# EasyEDA schematic easyeda.json
TITLE: welcome-ligh-up; REV: 1.0; Date: 2021-08-14; Sheet: 1/1; Drawn By: wednesday; Company: Your Company
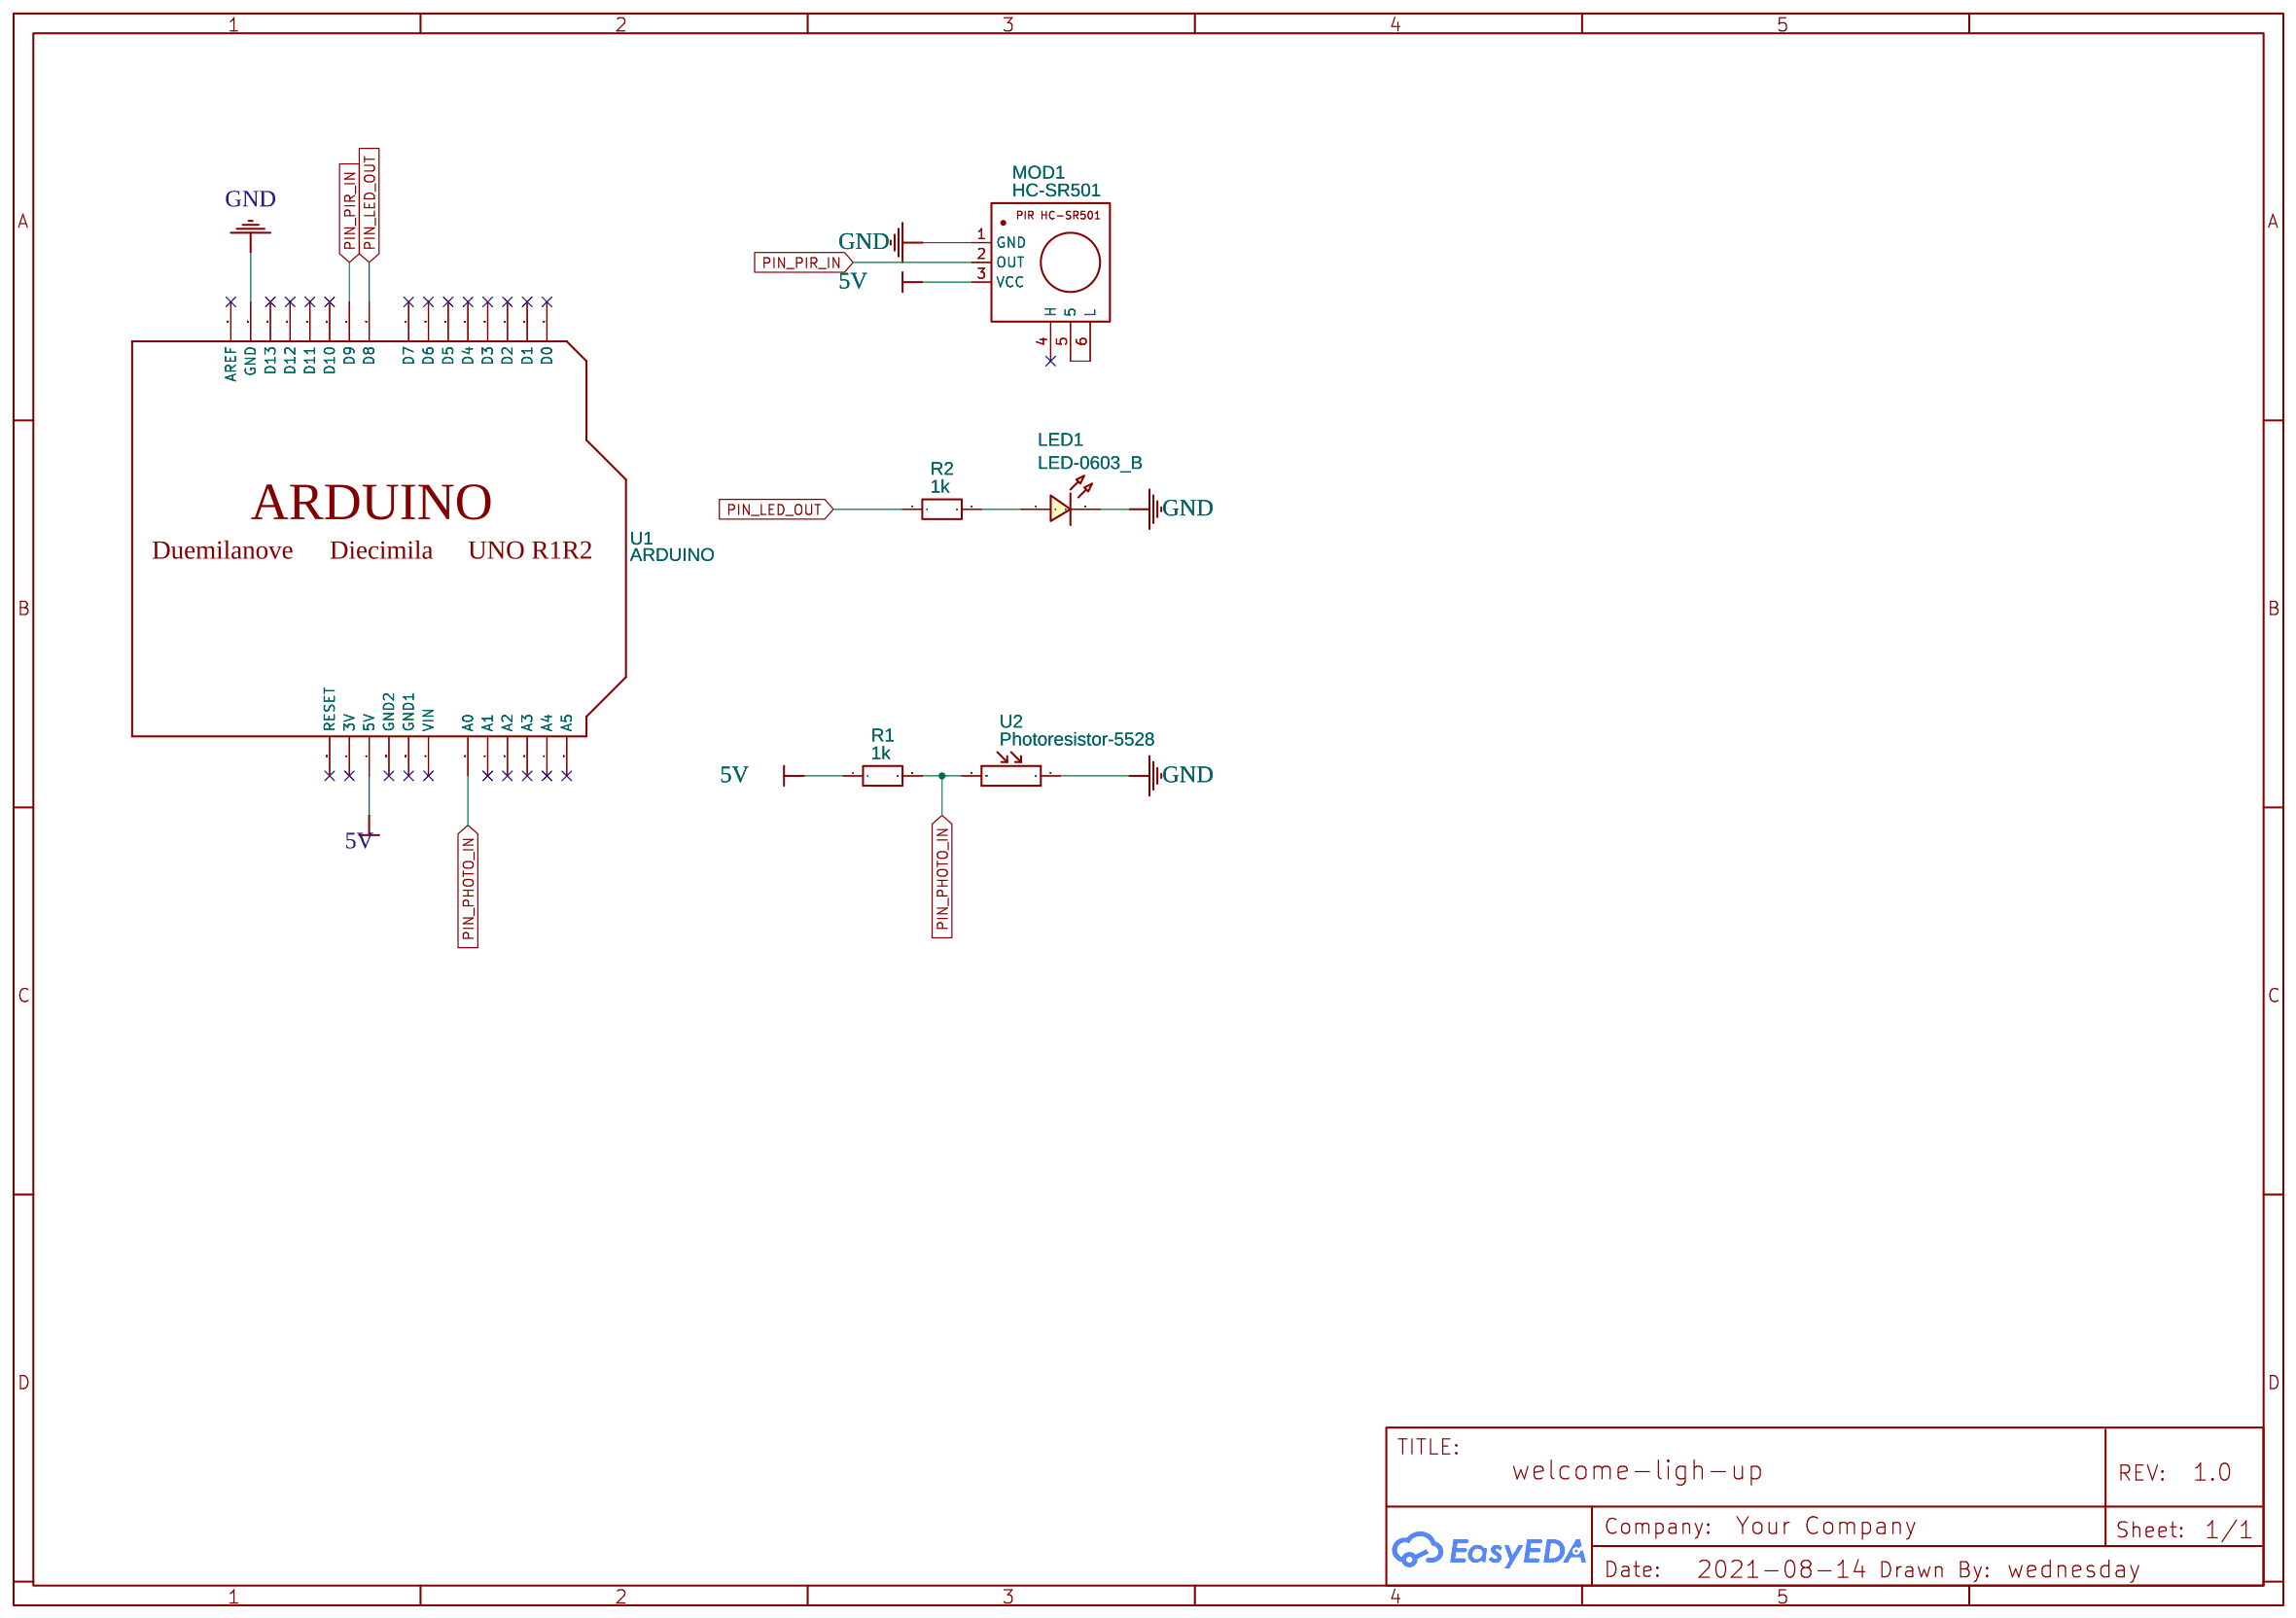
[diagram p0: schematic sheet]

## Parts
LED1  LED-0603_B  [LED0603_BLUE]
MOD1  HC-SR501  [PIR SR501 [PCB]]
R1  1k  [R0603]
R2  1k  [R0603]
U1  ARDUINO  [ARDUINO-NODIM]
U2  Photoresistor-5528  [SNR2-3.0]

## Library data of the parts
LED1 = LED-0603_B: Manufacturer: EVERLIGHT(台湾亿光); Manufacturer Part: 19-217/BHC-ZL1M2RY/3T; Supplier Part: C72041; Supplier: LCSC; Contributor: LCEDA_01
MOD1 = HC-SR501: Manufacturer Part: PIR SR502; Supplier: SHIVRAM; Supplier Part: PIR MODULE SR502; Manufacturer: SHIVRAM; link: NEW; Contributor: Dhawal Agrawal
R1 R2 = R_0603_EU: Contributor: LCEDA_Lib
U1 = ARDUINO: Contributor: Adafruit
U2 = Photoresistor-5528: DIP RES Photoresistor 10K;2P-3.0

## Nets
5V: MOD1.3(VCC) R1.1 U1.5V
GND: LED1.2 MOD1.1(GND) U1.GND U2.2(P$2)
PIN_LED_OUT: R2.1 U1.D8
PIN_PHOTO_IN: R1.2 U1.A0 U2.1(P$1)
PIN_PIR_IN: MOD1.2(OUT) U1.D9
Net-(LED1-1): LED1.1 R2.2
Net-(MOD1-5): MOD1.5 MOD1.6(L)

Not connected (* = marked no-connect by the designer): MOD1 4(H)*; U1 3V* A1* A2* A3* A4* A5* AREF* D0* D1* D2* D3* D4* D5* D6* D7* D10* D11* D12* D13* GND1* GND2* RESET* VIN*
